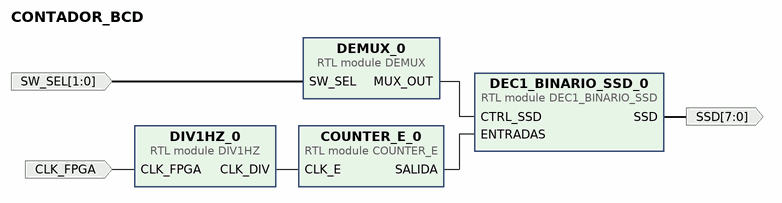
[diagram p0: block diagram of the top level]
# Vivado block design CONTADOR_BCD, xc7a35tcpg236-1, Vivado 2020.1
create_bd_design CONTADOR_BCD

create_bd_port -dir I CLK_FPGA
create_bd_port -dir I -from 1 -to 0 SW_SEL
create_bd_port -dir O -from 7 -to 0 SSD

create_bd_cell -type module -reference COUNTER_E COUNTER_E_0
create_bd_cell -type module -reference DIV1HZ DIV1HZ_0
create_bd_cell -type module -reference DEC1_BINARIO_SSD DEC1_BINARIO_SSD_0
create_bd_cell -type module -reference DEMUX DEMUX_0

# ---- connections ----

connect_bd_net [get_bd_pins DIV1HZ_0/CLK_DIV] [get_bd_pins COUNTER_E_0/CLK_E]
connect_bd_net [get_bd_pins COUNTER_E_0/SALIDA] [get_bd_pins DEC1_BINARIO_SSD_0/ENTRADAS]
connect_bd_net [get_bd_pins DEMUX_0/MUX_OUT] [get_bd_pins DEC1_BINARIO_SSD_0/CTRL_SSD]
connect_bd_net [get_bd_ports CLK_FPGA] [get_bd_pins DIV1HZ_0/CLK_FPGA]
connect_bd_net [get_bd_ports SW_SEL] [get_bd_pins DEMUX_0/SW_SEL]
connect_bd_net [get_bd_pins DEC1_BINARIO_SSD_0/SSD] [get_bd_ports SSD]

validate_bd_design
save_bd_design
